# Altium project CorgiSDR.PrjPcb
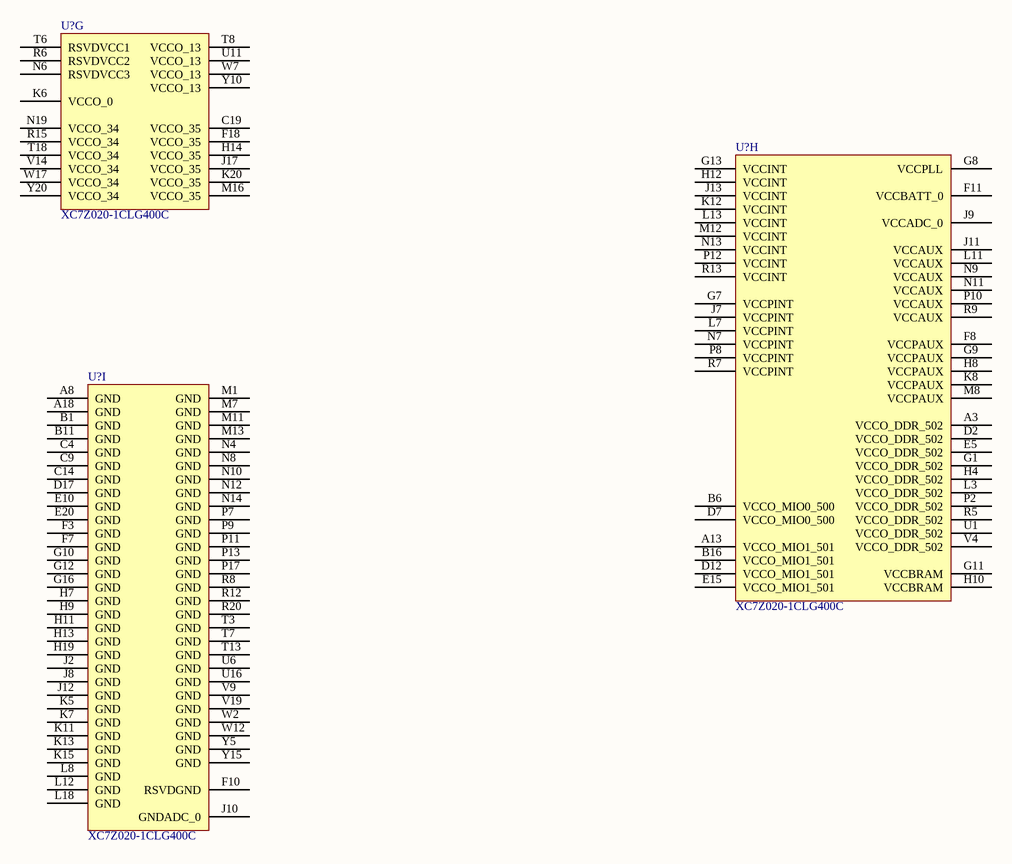
[diagram p0: FPGA Power.SchDoc]
8 sheets, 80 parts. Net scope: global (net labels, ports and power ports of the same name join across sheets).
Board file: CorgiSDR.PcbDoc
Sheets:
  FPGA Power.SchDoc
  DDR3 Memory Module One.SchDoc
  DDR3 Memory Module Two.SchDoc
  Memory Controller.SchDoc
  DDR3L Bypassing.SchDoc
  AD9361 RF Frontend.SchDoc
  AD9361 Baseband and Control.SchDoc
  AD9361 Power.SchDoc

## Sheet FPGA Power.SchDoc
size A4

### Parts
(Parts that share a designator on the sheet are numbered #1, #2 ... from top to bottom, then left to right.)
U?#1  XC7Z020-1CLG400C  [CLG400]  (part G of 9)
U?#2  XC7Z020-1CLG400C  [CLG400]  (part H of 9)
U?#3  XC7Z020-1CLG400C  [CLG400]  (part I of 9)

### Nets

Not connected (* = marked no-connect by the designer): U?#1 C19(VCCO_35) F18(VCCO_35) H14(VCCO_35) J17(VCCO_35) K6(VCCO_0) K20(VCCO_35) M16(VCCO_35) N6(RSVDVCC3) N19(VCCO_34) R6(RSVDVCC2) R15(VCCO_34) T6(RSVDVCC1) T8(VCCO_13) T18(VCCO_34) U11(VCCO_13) V14(VCCO_34) W7(VCCO_13) W17(VCCO_34) Y10(VCCO_13) Y20(VCCO_34); U?#2 A3(VCCO_DDR_502) A13(VCCO_MIO1_501) B6(VCCO_MIO0_500) B16(VCCO_MIO1_501) D2(VCCO_DDR_502) D7(VCCO_MIO0_500) D12(VCCO_MIO1_501) E5(VCCO_DDR_502) E15(VCCO_MIO1_501) F8(VCCPAUX) F11(VCCBATT_0) G1(VCCO_DDR_502) G7(VCCPINT) G8(VCCPLL) G9(VCCPAUX) G11(VCCBRAM) G13(VCCINT) H4(VCCO_DDR_502) H8(VCCPAUX) H10(VCCBRAM) H12(VCCINT) J7(VCCPINT) J9(VCCADC_0) J11(VCCAUX) J13(VCCINT) K8(VCCPAUX) K12(VCCINT) L3(VCCO_DDR_502) L7(VCCPINT) L11(VCCAUX) L13(VCCINT) M8(VCCPAUX) M12(VCCINT) N7(VCCPINT) N9(VCCAUX) N11(VCCAUX) N13(VCCINT) P2(VCCO_DDR_502) P8(VCCPINT) P10(VCCAUX) P12(VCCINT) R5(VCCO_DDR_502) R7(VCCPINT) R9(VCCAUX) R13(VCCINT) U1(VCCO_DDR_502) V4(VCCO_DDR_502); U?#3 A8(GND) A18(GND) B1(GND) B11(GND) C4(GND) C9(GND) C14(GND) D17(GND) E10(GND) E20(GND) F3(GND) F7(GND) F10(RSVDGND) G10(GND) G12(GND) G16(GND) H7(GND) H9(GND) H11(GND) H13(GND) H19(GND) J2(GND) J8(GND) J10(GNDADC_0) J12(GND) K5(GND) K7(GND) K11(GND) K13(GND) K15(GND) L8(GND) L12(GND) L18(GND) M1(GND) M7(GND) M11(GND) M13(GND) N4(GND) N8(GND) N10(GND) N12(GND) N14(GND) P7(GND) P9(GND) P11(GND) P13(GND) P17(GND) R8(GND) R12(GND) R20(GND) T3(GND) T7(GND) T13(GND) U6(GND) U16(GND) V9(GND) V19(GND) W2(GND) W12(GND) Y5(GND) Y15(GND)

### Notes on the sheet
- Title
- Size:
- Date:
- A3
- Drawn by:
- Time:
- Revision:
- Sheet
- of
- File:

### Library data of the parts
U?#1-U?#3 = CMP-0363-00002-3: SoC - 667 MHz Zynq™-7000 AP SoC, 130 PS I/O, 125 FPGA I/O, 400-Ball BGA, Speed Grade 1, Commercial Grade, Pb-Free; Flip Flops: 106400; Speed Grade: -1; LUTs: 53200; Extensible Block RAM (# 36Kb Blocks): 560 KB (140); PackageVersion: Rev 1.1, 09/2012; ComponentLink1Description: Datasheet; ComponentLink2Description: Package Specification; ComponentLink6Description: PCB and Layout Guide; PackageDescription: Wire-Bond Chip-Scale BGA, Body 17 x 17 mm, 0.8 mm Pitch; RoHS: Pb-Free; DatasheetVersion: v1.2; Mounting Technology: Surface Mount; ComponentLink5Description: Packaging and Pinout; ComponentLink5URL: http://www.xilinx.com/support/documentation/user_guides/ug865-Zynq-7000-Pkg-Pinout.pdf; ComponentLink6URL: http://www.xilinx.com/support/documentation/user_guides/ug483_7Series_PCB.pdf; Generic Part Number: XC7Z020; ComponentLink3Description: DC and AC Switching Characteristics; ComponentLink2URL: http://www.xilinx.com/support/documentation/user_guides/ug865-Zynq-7000-Pkg-Pinout.pdf; ComponentLink4Description: Package File; ComponentLink1URL: http://www.xilinx.com/support/documentation/data_sheets/ds190-Zynq-7000-Overview.pdf; PackageReference: CLG400; ComponentLink3URL: http://www.xilinx.com/support/documentation/data_sheets/ds187-XC7Z010-XC7Z020-Data-Sheet.pdf; PartNumber: XC7Z020-1CLG400C; ComponentLink4URL: http://www.xilinx.com/support/packagefiles/z7packages/xc7z020clg400pkg.txt; Code_JEDEC: MO-275-MMAA-1

## Sheet DDR3 Memory Module One.SchDoc: DDR3L Module (1/2)
size A4; DrawnBy: Chris Segiet; Revision: v1.0.0
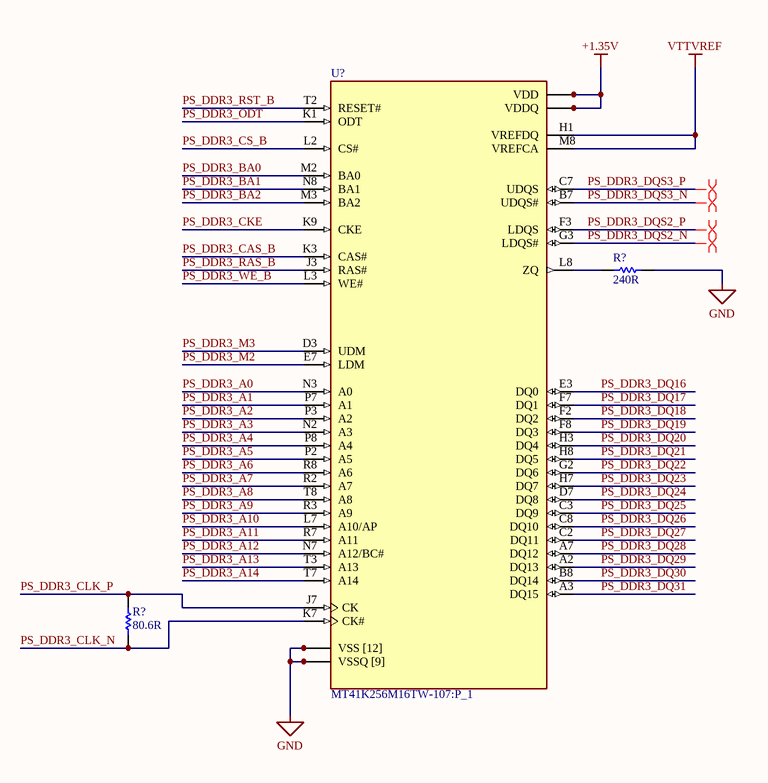
[diagram p1: DDR3 Memory Module One.SchDoc]

### Parts
(Parts that share a designator on the sheet are numbered #1, #2 ... from top to bottom, then left to right.)
R?#1  240R  [RESC1005X40X25NL05T05]
R?#2  80.6R  [RESC1005X40X25NL05T05]
U?#4  MT41K256M16TW-107:P_1  [BGA96C80P9X16_1400X800X120]

### Nets
+1.35V: R?#1.2 U?#4.A1(VDDQ) U?#4.A8(VDDQ) U?#4.A9(VSS_[12]) U?#4.B1(VSSQ) U?#4.B2(VDD) U?#4.B3(VSS) U?#4.B9(VSSQ) U?#4.C1(VDDQ) U?#4.C9(VDDQ) U?#4.D1(VSSQ) U?#4.D2(VDDQ) U?#4.D8(VSSQ) U?#4.D9(VDD) U?#4.E1(VSS) U?#4.E2(VSSQ) U?#4.E8(VSSQ) U?#4.E9(VDDQ) U?#4.F1(VDDQ) U?#4.F9(VSSQ) U?#4.G1(VSSQ) U?#4.G7(VDD) U?#4.G8(VSS) U?#4.G9(VSSQ_[9]) U?#4.H2(VDDQ) U?#4.H9(VDDQ) U?#4.J2(VSS) U?#4.J8(VSS) U?#4.K2(VDD) U?#4.K8(VDD) U?#4.M1(VSS) U?#4.M9(VSS) U?#4.N1(VDD) U?#4.N9(VDD) U?#4.P1(VSS) U?#4.P9(VSS) U?#4.R1(VDD) U?#4.R9(VDD) U?#4.T1(VSS) U?#4.T9(VSS)  [also labelled GND]
VTTVREF: U?#4.H1(VREFDQ) U?#4.M8(VREFCA)  [project net PS_DDR_VREF0]
PS_DDR3_A0: U?#4.N3(A0)
PS_DDR3_A1: U?#4.P7(A1)
PS_DDR3_A2: U?#4.P3(A2)
PS_DDR3_A3: U?#4.N2(A3)
PS_DDR3_A4: U?#4.P8(A4)
PS_DDR3_A5: U?#4.P2(A5)
PS_DDR3_A6: U?#4.R8(A6)
PS_DDR3_A7: U?#4.R2(A7)
PS_DDR3_A8: U?#4.T8(A8)
PS_DDR3_A9: U?#4.R3(A9)
PS_DDR3_A10: U?#4.L7(A10/AP)
PS_DDR3_A11: U?#4.R7(A11)
PS_DDR3_A12: U?#4.N7(A12/BC#)
PS_DDR3_A13: U?#4.T3(A13)
PS_DDR3_A14: U?#4.T7(A14)
PS_DDR3_BA0: U?#4.M2(BA0)
PS_DDR3_BA1: U?#4.N8(BA1)
PS_DDR3_BA2: U?#4.M3(BA2)
PS_DDR3_CAS_B: U?#4.K3(CAS#)
PS_DDR3_CKE: U?#4.K9(CKE)
PS_DDR3_CLK_N: R?#2.2 U?#4.K7(CK#)
PS_DDR3_CLK_P: R?#2.1 U?#4.J7(CK)
PS_DDR3_CS_B: U?#4.L2(CS#)
PS_DDR3_DQ16: U?#4.E3(DQ0)
PS_DDR3_DQ17: U?#4.F7(DQ1)
PS_DDR3_DQ18: U?#4.F2(DQ2)
PS_DDR3_DQ19: U?#4.F8(DQ3)
PS_DDR3_DQ20: U?#4.H3(DQ4)
PS_DDR3_DQ21: U?#4.H8(DQ5)
PS_DDR3_DQ22: U?#4.G2(DQ6)
PS_DDR3_DQ23: U?#4.H7(DQ7)
PS_DDR3_DQ24: U?#4.D7(DQ8)
PS_DDR3_DQ25: U?#4.C3(DQ9)
PS_DDR3_DQ26: U?#4.C8(DQ10)
PS_DDR3_DQ27: U?#4.C2(DQ11)
PS_DDR3_DQ28: U?#4.A7(DQ12)
PS_DDR3_DQ29: U?#4.A2(DQ13)
PS_DDR3_DQ30: U?#4.B8(DQ14)
PS_DDR3_DQ31: U?#4.A3(DQ15)
PS_DDR3_DQS2_N: U?#4.G3(LDQS#)
PS_DDR3_DQS2_P: U?#4.F3(LDQS)
PS_DDR3_DQS3_N: U?#4.B7(UDQS#)
PS_DDR3_DQS3_P: U?#4.C7(UDQS)
PS_DDR3_M2: U?#4.E7(LDM)
PS_DDR3_M3: U?#4.D3(UDM)
PS_DDR3_ODT: U?#4.K1(ODT)
PS_DDR3_RAS_B: U?#4.J3(RAS#)
PS_DDR3_RST_B: U?#4.T2(RESET#)
PS_DDR3_WE_B: U?#4.L3(WE#)
NetR?#1_1: R?#1.1 U?#4.L8(ZQ)

### Layout directives
differential pair: PS_DDR3_DQS2_N, PS_DDR3_DQS2_P, PS_DDR3_DQS3_N, PS_DDR3_DQS3_P

### Notes on the sheet
- Title
- Size:
- Date:
- A3
- Drawn by:
- Time:
- Revision:
- Sheet
- of
- File:

### Library data of the parts
R?#1 = CMP-2002-00493-3: Resistor - 240 Ohm, +/- 5%, 100 mW, 0402; PartNumber: ERJ-2GEJ241x; Manufacturer: Basic Passives; Resistance: 240 Ohm; Voltage Rating: 50 V; Case\/Package: 0402; Power Rating: 100 mW; PackageReference: 0402; ComponentLink1URL: http://www.panasonic.com/; ComponentLink2Description: Datasheet; PackageDescription: 2-Pin Surface Mount Device, Body 1 x 0.5 mm; Tolerance: 5%; Radiation Hardening: No; Packaging: Tape and Reel; Case Code (Metric): 1005; Case Code (Imperial): 0402; Mount: Surface Mount; REACH SVHC: Yes; Length: 1 mm; Mounting Technology: Surface Mount; Max Operating Temperature: 155 degC; Height: 0.35 mm; Width: 0.5 mm; Package Quantity: 10000; RoHSCompliant: true; DatasheetVersion: 03/2015; Pins: 2; ComponentLink1Description: Manufacturer URL; Min Operating Temperature: -55 degC; ComponentLink2URL: http://industrial.panasonic.com/cdbs/www-data/pdf/RDA0000/AOA0000C84.pdf
R?#2 = CMP-2002-01076-1: Resistor - 80.6R 1% 0.1W 0402; Manufacturer: Panasonic; Part Number: ERJ-2RKF80R6X; Resistance: 80.6; Category: Resistor; Tolerance: 1%; Power Rating: 0.1W; Case Code (Imperial): 0402
U?#4 = MT41K256M16TW-107:P_1: Memory - DDR3L Memory IC 4Gb (256M x 16) Parallel 933MHz 20ns 96-FBGA (8x14); MF: {'manufacturer': u'Micron Technology Inc.'}; Price: None; Value: *; Package: None; Availability: Unavailable; MP: MT41K256M16TW-107:P; Category: Memory

## Sheet DDR3 Memory Module Two.SchDoc: DDR3L Module (2/2)
size A4; DrawnBy: Chris Segiet; Revision: v1.0.0
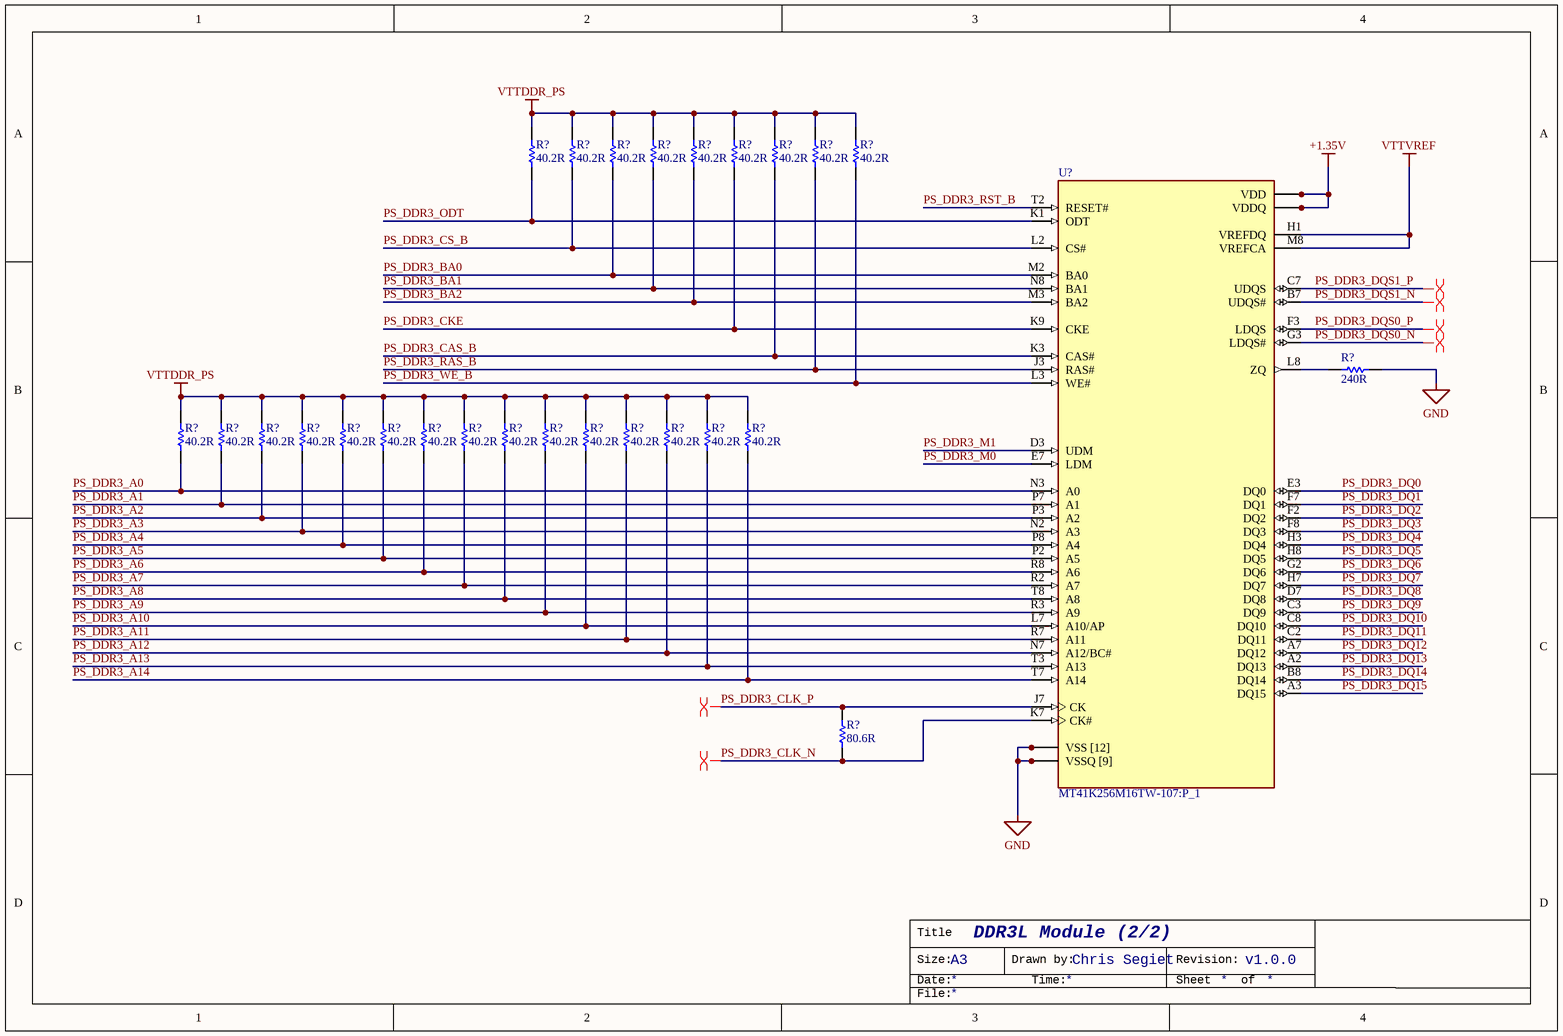
[diagram p2: DDR3 Memory Module Two.SchDoc]

### Parts
(Parts that share a designator on the sheet are numbered #1, #2 ... from top to bottom, then left to right.)
R?#3  40.2R  [FP-CRCW0603-e3-IPC_B]
R?#4  40.2R  [FP-CRCW0603-e3-IPC_B]
R?#5  40.2R  [FP-CRCW0603-e3-IPC_B]
R?#6  40.2R  [FP-CRCW0603-e3-IPC_B]
R?#7  40.2R  [FP-CRCW0603-e3-IPC_B]
R?#8  40.2R  [FP-CRCW0603-e3-IPC_B]
R?#9  40.2R  [FP-CRCW0603-e3-IPC_B]
R?#10  40.2R  [FP-CRCW0603-e3-IPC_B]
R?#11  40.2R  [FP-CRCW0603-e3-IPC_B]
R?#12  240R  [RESC1005X40X25NL05T05]
R?#13  40.2R  [FP-CRCW0603-e3-IPC_B]
R?#14  40.2R  [FP-CRCW0603-e3-IPC_B]
R?#15  40.2R  [FP-CRCW0603-e3-IPC_B]
R?#16  40.2R  [FP-CRCW0603-e3-IPC_B]
R?#17  40.2R  [FP-CRCW0603-e3-IPC_B]
R?#18  40.2R  [FP-CRCW0603-e3-IPC_B]
R?#19  40.2R  [FP-CRCW0603-e3-IPC_B]
R?#20  40.2R  [FP-CRCW0603-e3-IPC_B]
R?#21  40.2R  [FP-CRCW0603-e3-IPC_B]
R?#22  40.2R  [FP-CRCW0603-e3-IPC_B]
R?#23  40.2R  [FP-CRCW0603-e3-IPC_B]
R?#24  40.2R  [FP-CRCW0603-e3-IPC_B]
R?#25  40.2R  [FP-CRCW0603-e3-IPC_B]
R?#26  40.2R  [FP-CRCW0603-e3-IPC_B]
R?#27  40.2R  [FP-CRCW0603-e3-IPC_B]
R?#28  80.6R  [RESC1005X40X25NL05T05]
U?#5  MT41K256M16TW-107:P_1  [BGA96C80P9X16_1400X800X120]

### Nets
+1.35V: R?#12.2 U?#5.A1(VDDQ) U?#5.A8(VDDQ) U?#5.A9(VSS_[12]) U?#5.B1(VSSQ) U?#5.B2(VDD) U?#5.B3(VSS) U?#5.B9(VSSQ) U?#5.C1(VDDQ) U?#5.C9(VDDQ) U?#5.D1(VSSQ) U?#5.D2(VDDQ) U?#5.D8(VSSQ) U?#5.D9(VDD) U?#5.E1(VSS) U?#5.E2(VSSQ) U?#5.E8(VSSQ) U?#5.E9(VDDQ) U?#5.F1(VDDQ) U?#5.F9(VSSQ) U?#5.G1(VSSQ) U?#5.G7(VDD) U?#5.G8(VSS) U?#5.G9(VSSQ_[9]) U?#5.H2(VDDQ) U?#5.H9(VDDQ) U?#5.J2(VSS) U?#5.J8(VSS) U?#5.K2(VDD) U?#5.K8(VDD) U?#5.M1(VSS) U?#5.M9(VSS) U?#5.N1(VDD) U?#5.N9(VDD) U?#5.P1(VSS) U?#5.P9(VSS) U?#5.R1(VDD) U?#5.R9(VDD) U?#5.T1(VSS) U?#5.T9(VSS)  [also labelled GND]
VTTDDR_PS: R?#3.2 R?#4.2 R?#5.2 R?#6.2 R?#7.2 R?#8.2 R?#9.2 R?#10.2 R?#11.2 R?#13.2 R?#14.2 R?#15.2 R?#16.2 R?#17.2 R?#18.2 R?#19.2 R?#20.2 R?#21.2 R?#22.2 R?#23.2 R?#24.2 R?#25.2 R?#26.2 R?#27.2
VTTVREF: U?#5.H1(VREFDQ) U?#5.M8(VREFCA)  [project net PS_DDR_VREF0]
PS_DDR3_A0: R?#13.1 U?#5.N3(A0)
PS_DDR3_A1: R?#14.1 U?#5.P7(A1)
PS_DDR3_A2: R?#15.1 U?#5.P3(A2)
PS_DDR3_A3: R?#16.1 U?#5.N2(A3)
PS_DDR3_A4: R?#17.1 U?#5.P8(A4)
PS_DDR3_A5: R?#18.1 U?#5.P2(A5)
PS_DDR3_A6: R?#19.1 U?#5.R8(A6)
PS_DDR3_A7: R?#20.1 U?#5.R2(A7)
PS_DDR3_A8: R?#21.1 U?#5.T8(A8)
PS_DDR3_A9: R?#22.1 U?#5.R3(A9)
PS_DDR3_A10: R?#23.1 U?#5.L7(A10/AP)
PS_DDR3_A11: R?#24.1 U?#5.R7(A11)
PS_DDR3_A12: R?#25.1 U?#5.N7(A12/BC#)
PS_DDR3_A13: R?#26.1 U?#5.T3(A13)
PS_DDR3_A14: R?#27.1 U?#5.T7(A14)
PS_DDR3_BA0: R?#5.1 U?#5.M2(BA0)
PS_DDR3_BA1: R?#6.1 U?#5.N8(BA1)
PS_DDR3_BA2: R?#7.1 U?#5.M3(BA2)
PS_DDR3_CAS_B: R?#9.1 U?#5.K3(CAS#)
PS_DDR3_CKE: R?#8.1 U?#5.K9(CKE)
PS_DDR3_CLK_N: R?#28.1 U?#5.K7(CK#)
PS_DDR3_CLK_P: R?#28.2 U?#5.J7(CK)
PS_DDR3_CS_B: R?#4.1 U?#5.L2(CS#)
PS_DDR3_DQ0: U?#5.E3(DQ0)
PS_DDR3_DQ1: U?#5.F7(DQ1)
PS_DDR3_DQ2: U?#5.F2(DQ2)
PS_DDR3_DQ3: U?#5.F8(DQ3)
PS_DDR3_DQ4: U?#5.H3(DQ4)
PS_DDR3_DQ5: U?#5.H8(DQ5)
PS_DDR3_DQ6: U?#5.G2(DQ6)
PS_DDR3_DQ7: U?#5.H7(DQ7)
PS_DDR3_DQ8: U?#5.D7(DQ8)
PS_DDR3_DQ9: U?#5.C3(DQ9)
PS_DDR3_DQ10: U?#5.C8(DQ10)
PS_DDR3_DQ11: U?#5.C2(DQ11)
PS_DDR3_DQ12: U?#5.A7(DQ12)
PS_DDR3_DQ13: U?#5.A2(DQ13)
PS_DDR3_DQ14: U?#5.B8(DQ14)
PS_DDR3_DQ15: U?#5.A3(DQ15)
PS_DDR3_DQS0_N: U?#5.G3(LDQS#)
PS_DDR3_DQS0_P: U?#5.F3(LDQS)
PS_DDR3_DQS1_N: U?#5.B7(UDQS#)
PS_DDR3_DQS1_P: U?#5.C7(UDQS)
PS_DDR3_M0: U?#5.E7(LDM)
PS_DDR3_M1: U?#5.D3(UDM)
PS_DDR3_ODT: R?#3.1 U?#5.K1(ODT)
PS_DDR3_RAS_B: R?#10.1 U?#5.J3(RAS#)
PS_DDR3_RST_B: U?#5.T2(RESET#)
PS_DDR3_WE_B: R?#11.1 U?#5.L3(WE#)
NetR?#12_1: R?#12.1 U?#5.L8(ZQ)

### Layout directives
differential pair: PS_DDR3_CLK_N, PS_DDR3_CLK_P, PS_DDR3_DQS0_N, PS_DDR3_DQS0_P, PS_DDR3_DQS1_N, PS_DDR3_DQS1_P

### Notes on the sheet
- Title
- Size:
- Date:
- A3
- Drawn by:
- Time:
- Revision:
- Sheet
- of
- File:

### Library data of the parts
R?#3-R?#11 R?#13-R?#27 = CMP-1012-00352-3: Resistor - 40.2Ω, 1%, 0.1W, 100ppm/°C, 0603; Max Power Dissipation: 100mW; Voltage Rating (DC): 75V; Packaging: Tape and Reel; Mount: Surface Mount; Composition: Thick Film; Case Code (Metric): 1608; Case/Package: 0603; Radiation Hardening: No; Min Operating Temperature: -55°C; Resistance: 40.2R; Power Rating: 100mW; Width: 0.033inch; Temperature Coefficient: 100ppm/°C; Tolerance: 1%; Termination: SMD/SMT; Case Code (Imperial): 0603; Features: Automotive AEC-Q200; Lead Free: Lead Free; Number of Terminations: 2; Max Operating Temperature: 155°C; Height: 0.45mm; Depth: 0.85mm; Military Standard: Not; Number of Pins: 2; Package Quantity: 10; Contact Plating: Tin; Weight: 7.1E-05oz; Voltage Rating: 75V; Length: 1.55mm
R?#12 = CMP-2002-00493-3: as R?#1 on sheet DDR3 Memory Module One; PackageReference: 0402; ComponentLink1URL: http://www.panasonic.com/; ComponentLink2Description: Datasheet; PackageDescription: 2-Pin Surface Mount Device, Body 1 x 0.5 mm; Tolerance: 5%; Radiation Hardening: No; Packaging: Tape and Reel; Case Code (Metric): 1005; Case Code (Imperial): 0402; Mount: Surface Mount; REACH SVHC: Yes; Length: 1 mm; Mounting Technology: Surface Mount; Max Operating Temperature: 155 degC; Height: 0.35 mm; Width: 0.5 mm; Package Quantity: 10000; RoHSCompliant: true; DatasheetVersion: 03/2015; Pins: 2; ComponentLink1Description: Manufacturer URL; Min Operating Temperature: -55 degC; ComponentLink2URL: http://industrial.panasonic.com/cdbs/www-data/pdf/RDA0000/AOA0000C84.pdf
R?#28 = CMP-2002-01076-1: as R?#2 on sheet DDR3 Memory Module One; Category: Resistor; Tolerance: 1%; Power Rating: 0.1W; Case Code (Imperial): 0402
U?#5 = MT41K256M16TW-107:P_1: as U?#4 on sheet DDR3 Memory Module One; Price: None; Value: *; Package: None; Availability: Unavailable; MP: MT41K256M16TW-107:P; Category: Memory

## Sheet Memory Controller.SchDoc: DDR3L Memory Controller (HPS)
size A4; DrawnBy: Chris Segiet; Revision: v1.0.0
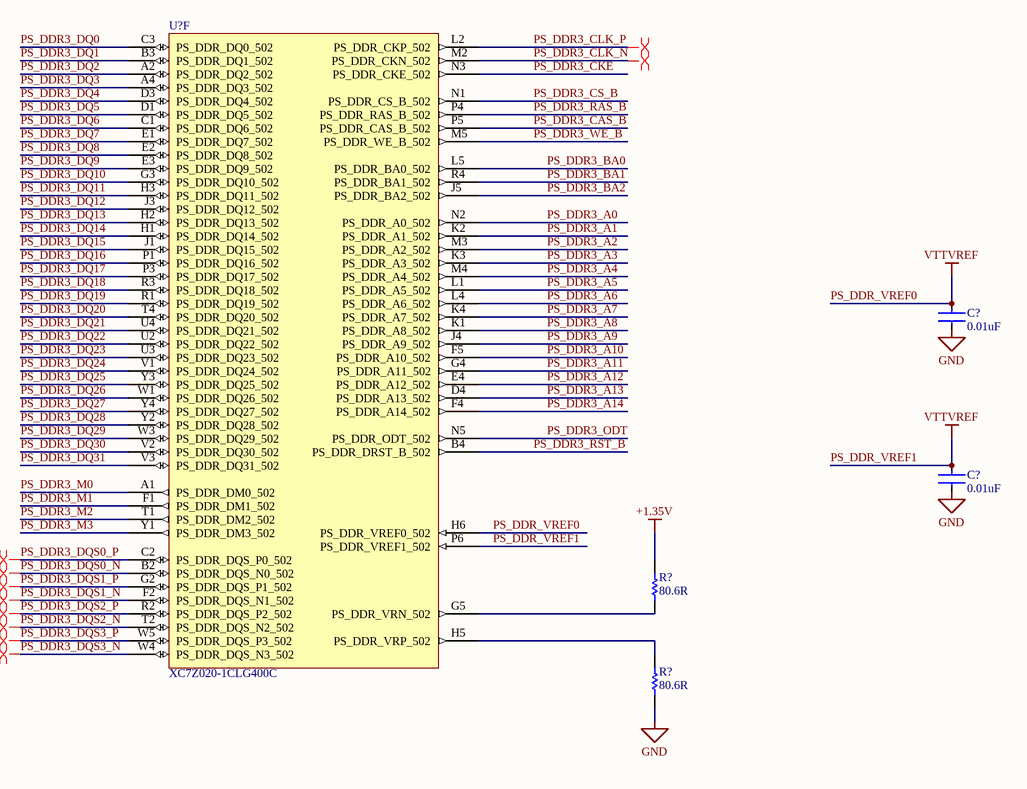
[diagram p3: Memory Controller.SchDoc]

### Parts
(Parts that share a designator on the sheet are numbered #1, #2 ... from top to bottom, then left to right.)
C?#1  0.01uF  [FP-C1005-050-0_05-IPC_B]
C?#2  0.01uF  [FP-C1005-050-0_05-IPC_B]
R?#29  80.6R  [RESC1005X40X25NL05T05]
R?#30  80.6R  [RESC1005X40X25NL05T05]
U?#6  XC7Z020-1CLG400C  [CLG400]  (part F of 9)

### Nets
+1.35V: C?#1.2 C?#2.2 R?#29.2 R?#30.1  [also labelled GND]
PS_DDR_VREF0: C?#1.1 C?#2.1 U?#6.H6(PS_DDR_VREF0_502) U?#6.P6(PS_DDR_VREF1_502)  [also labelled PS_DDR_VREF1, VTTVREF]
PS_DDR3_A0: U?#6.N2(PS_DDR_A0_502)
PS_DDR3_A1: U?#6.K2(PS_DDR_A1_502)
PS_DDR3_A2: U?#6.M3(PS_DDR_A2_502)
PS_DDR3_A3: U?#6.K3(PS_DDR_A3_502)
PS_DDR3_A4: U?#6.M4(PS_DDR_A4_502)
PS_DDR3_A5: U?#6.L1(PS_DDR_A5_502)
PS_DDR3_A6: U?#6.L4(PS_DDR_A6_502)
PS_DDR3_A7: U?#6.K4(PS_DDR_A7_502)
PS_DDR3_A8: U?#6.K1(PS_DDR_A8_502)
PS_DDR3_A9: U?#6.J4(PS_DDR_A9_502)
PS_DDR3_A10: U?#6.F5(PS_DDR_A10_502)
PS_DDR3_A11: U?#6.G4(PS_DDR_A11_502)
PS_DDR3_A12: U?#6.E4(PS_DDR_A12_502)
PS_DDR3_A13: U?#6.D4(PS_DDR_A13_502)
PS_DDR3_A14: U?#6.F4(PS_DDR_A14_502)
PS_DDR3_BA0: U?#6.L5(PS_DDR_BA0_502)
PS_DDR3_BA1: U?#6.R4(PS_DDR_BA1_502)
PS_DDR3_BA2: U?#6.J5(PS_DDR_BA2_502)
PS_DDR3_CAS_B: U?#6.P5(PS_DDR_CAS_B_502)
PS_DDR3_CKE: U?#6.N3(PS_DDR_CKE_502)
PS_DDR3_CLK_N: U?#6.M2(PS_DDR_CKN_502)
PS_DDR3_CLK_P: U?#6.L2(PS_DDR_CKP_502)
PS_DDR3_CS_B: U?#6.N1(PS_DDR_CS_B_502)
PS_DDR3_DQ0: U?#6.C3(PS_DDR_DQ0_502)
PS_DDR3_DQ1: U?#6.B3(PS_DDR_DQ1_502)
PS_DDR3_DQ2: U?#6.A2(PS_DDR_DQ2_502)
PS_DDR3_DQ3: U?#6.A4(PS_DDR_DQ3_502)
PS_DDR3_DQ4: U?#6.D3(PS_DDR_DQ4_502)
PS_DDR3_DQ5: U?#6.D1(PS_DDR_DQ5_502)
PS_DDR3_DQ6: U?#6.C1(PS_DDR_DQ6_502)
PS_DDR3_DQ7: U?#6.E1(PS_DDR_DQ7_502)
PS_DDR3_DQ8: U?#6.E2(PS_DDR_DQ8_502)
PS_DDR3_DQ9: U?#6.E3(PS_DDR_DQ9_502)
PS_DDR3_DQ10: U?#6.G3(PS_DDR_DQ10_502)
PS_DDR3_DQ11: U?#6.H3(PS_DDR_DQ11_502)
PS_DDR3_DQ12: U?#6.J3(PS_DDR_DQ12_502)
PS_DDR3_DQ13: U?#6.H2(PS_DDR_DQ13_502)
PS_DDR3_DQ14: U?#6.H1(PS_DDR_DQ14_502)
PS_DDR3_DQ15: U?#6.J1(PS_DDR_DQ15_502)
PS_DDR3_DQ16: U?#6.P1(PS_DDR_DQ16_502)
PS_DDR3_DQ17: U?#6.P3(PS_DDR_DQ17_502)
PS_DDR3_DQ18: U?#6.R3(PS_DDR_DQ18_502)
PS_DDR3_DQ19: U?#6.R1(PS_DDR_DQ19_502)
PS_DDR3_DQ20: U?#6.T4(PS_DDR_DQ20_502)
PS_DDR3_DQ21: U?#6.U4(PS_DDR_DQ21_502)
PS_DDR3_DQ22: U?#6.U2(PS_DDR_DQ22_502)
PS_DDR3_DQ23: U?#6.U3(PS_DDR_DQ23_502)
PS_DDR3_DQ24: U?#6.V1(PS_DDR_DQ24_502)
PS_DDR3_DQ25: U?#6.Y3(PS_DDR_DQ25_502)
PS_DDR3_DQ26: U?#6.W1(PS_DDR_DQ26_502)
PS_DDR3_DQ27: U?#6.Y4(PS_DDR_DQ27_502)
PS_DDR3_DQ28: U?#6.Y2(PS_DDR_DQ28_502)
PS_DDR3_DQ29: U?#6.W3(PS_DDR_DQ29_502)
PS_DDR3_DQ30: U?#6.V2(PS_DDR_DQ30_502)
PS_DDR3_DQ31: U?#6.V3(PS_DDR_DQ31_502)
PS_DDR3_DQS0_N: U?#6.B2(PS_DDR_DQS_N0_502)
PS_DDR3_DQS0_P: U?#6.C2(PS_DDR_DQS_P0_502)
PS_DDR3_DQS1_N: U?#6.F2(PS_DDR_DQS_N1_502)
PS_DDR3_DQS1_P: U?#6.G2(PS_DDR_DQS_P1_502)
PS_DDR3_DQS2_N: U?#6.T2(PS_DDR_DQS_N2_502)
PS_DDR3_DQS2_P: U?#6.R2(PS_DDR_DQS_P2_502)
PS_DDR3_DQS3_N: U?#6.W4(PS_DDR_DQS_N3_502)
PS_DDR3_DQS3_P: U?#6.W5(PS_DDR_DQS_P3_502)
PS_DDR3_M0: U?#6.A1(PS_DDR_DM0_502)
PS_DDR3_M1: U?#6.F1(PS_DDR_DM1_502)
PS_DDR3_M2: U?#6.T1(PS_DDR_DM2_502)
PS_DDR3_M3: U?#6.Y1(PS_DDR_DM3_502)
PS_DDR3_ODT: U?#6.N5(PS_DDR_ODT_502)
PS_DDR3_RAS_B: U?#6.P4(PS_DDR_RAS_B_502)
PS_DDR3_RST_B: U?#6.B4(PS_DDR_DRST_B_502)
PS_DDR3_WE_B: U?#6.M5(PS_DDR_WE_B_502)
NetR?#29_1: R?#29.1 U?#6.G5(PS_DDR_VRN_502)
NetR?#30_2: R?#30.2 U?#6.H5(PS_DDR_VRP_502)

### Layout directives
differential pair: PS_DDR3_CLK_N, PS_DDR3_CLK_P, PS_DDR3_DQS0_N, PS_DDR3_DQS0_P, PS_DDR3_DQS1_N, PS_DDR3_DQS1_P, PS_DDR3_DQS2_N, PS_DDR3_DQS2_P, PS_DDR3_DQS3_N, PS_DDR3_DQS3_P

### Notes on the sheet
- Title
- Size:
- Date:
- A3
- Drawn by:
- Time:
- Revision:
- Sheet
- of
- File:

### Library data of the parts
C?#1 C?#2 = CMP-08246-000726-2: Multilayer Ceramic Capacitors 10nF ±10% 25V X8R SMD 0402; Dissipation Factor: 3%; Length: 1mm; Capacitance: 10nF; Termination: SMD/SMT; Packaging: Tape and Reel; Weight: 2.3E-05oz; Resistor Type: Ceramic; Case/Package: 0402; Number of Pins: 2; Voltage Rating (DC): 25V; Voltage: 25V; Width: 0.02inch; Tolerance: 10%; Depth: 0.5mm; Case Code (Metric): 1005; Dielectric: X8R; RoHS Compliant: Yes; Max Operating Temperature: 150°C; Features: High Temperature; Voltage Rating: 25V; REACH SVHC: No SVHC; Series: C; Package Quantity: 10000; Mount: Surface Mount; Dielectric Material: Ceramic; Case Code (Imperial): 0402; Lead Free: Lead Free; Thickness: 0.022inch; Height: 0.5mm; Min Operating Temperature: -55°C
R?#29 R?#30 = CMP-2002-01076-1: 80.6 ohm 1% 0402; Manufacturer: Panasonic; Part Number: ERJ-2RKF80R6X
U?#6 = CMP-0363-00002-3: 667 MHz Zynq™-7000 AP SoC, 130 PS I/O, 125 FPGA I/O, 400-Ball BGA, Speed Grade 1, Commercial Grade, Pb-Free; Flip Flops: 106400; Speed Grade: -1; LUTs: 53200; Extensible Block RAM (# 36Kb Blocks): 560 KB (140); PackageVersion: Rev 1.1, 09/2012; ComponentLink1Description: Datasheet; ComponentLink2Description: Package Specification; ComponentLink6Description: PCB and Layout Guide; PackageDescription: Wire-Bond Chip-Scale BGA, Body 17 x 17 mm, 0.8 mm Pitch; RoHS: Pb-Free; DatasheetVersion: v1.2; Mounting Technology: Surface Mount; ComponentLink5Description: Packaging and Pinout; ComponentLink5URL: http://www.xilinx.com/support/documentation/user_guides/ug865-Zynq-7000-Pkg-Pinout.pdf; ComponentLink6URL: http://www.xilinx.com/support/documentation/user_guides/ug483_7Series_PCB.pdf; Generic Part Number: XC7Z020; ComponentLink3Description: DC and AC Switching Characteristics; ComponentLink2URL: http://www.xilinx.com/support/documentation/user_guides/ug865-Zynq-7000-Pkg-Pinout.pdf; ComponentLink4Description: Package File; ComponentLink1URL: http://www.xilinx.com/support/documentation/data_sheets/ds190-Zynq-7000-Overview.pdf; PackageReference: CLG400; ComponentLink3URL: http://www.xilinx.com/support/documentation/data_sheets/ds187-XC7Z010-XC7Z020-Data-Sheet.pdf; PartNumber: XC7Z020-1CLG400C; ComponentLink4URL: http://www.xilinx.com/support/packagefiles/z7packages/xc7z020clg400pkg.txt; Code_JEDEC: MO-275-MMAA-1

## Sheet DDR3L Bypassing.SchDoc: DDR3L Bypassing
size A4; DrawnBy: Chris Segiet; Revision: v1.0.0
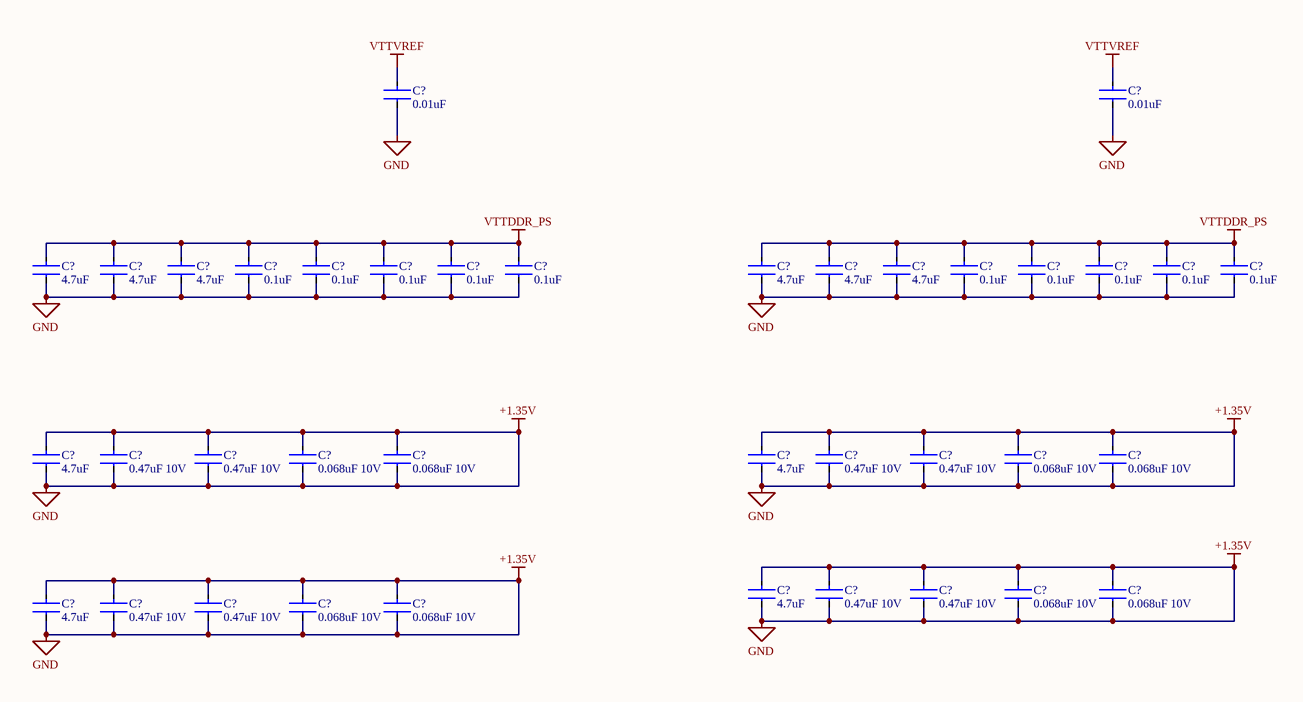
[diagram p4: DDR3L Bypassing.SchDoc]

### Parts
(Parts that share a designator on the sheet are numbered #1, #2 ... from top to bottom, then left to right.)
C?#3  0.01uF  [FP-C1005-050-0_05-IPC_B]
C?#4  0.01uF  [FP-C1005-050-0_05-IPC_B]
C?#5  4.7uF  [FP-C2012-125-0_2-IPC_B]
C?#6  4.7uF  [FP-C2012-125-0_2-IPC_B]
C?#7  4.7uF  [FP-C2012-125-0_2-IPC_B]
C?#8  0.1uF  [FP-CGA3E-0_3-0_1-IPC_B]
C?#9  0.1uF  [FP-CGA3E-0_3-0_1-IPC_B]
C?#10  0.1uF  [FP-CGA3E-0_3-0_1-IPC_B]
C?#11  0.1uF  [FP-CGA3E-0_3-0_1-IPC_B]
C?#12  0.1uF  [FP-CGA3E-0_3-0_1-IPC_B]
C?#13  4.7uF  [FP-C2012-125-0_2-IPC_B]
C?#14  4.7uF  [FP-C2012-125-0_2-IPC_B]
C?#15  4.7uF  [FP-C2012-125-0_2-IPC_B]
C?#16  0.1uF  [FP-CGA3E-0_3-0_1-IPC_B]
C?#17  0.1uF  [FP-CGA3E-0_3-0_1-IPC_B]
C?#18  0.1uF  [FP-CGA3E-0_3-0_1-IPC_B]
C?#19  0.1uF  [FP-CGA3E-0_3-0_1-IPC_B]
C?#20  0.1uF  [FP-CGA3E-0_3-0_1-IPC_B]
C?#21  4.7uF  [FP-C2012-125-0_2-IPC_B]
C?#22  0.47uF 10V  [FP-GRM15-0_1-IPC_B]
C?#23  0.47uF 10V  [FP-GRM15-0_1-IPC_B]
C?#24  0.068uF 10V  [FP-C1005-050-0_05-IPC_B]
C?#25  0.068uF 10V  [FP-C1005-050-0_05-IPC_B]
C?#26  4.7uF  [FP-C2012-125-0_2-IPC_B]
C?#27  0.47uF 10V  [FP-GRM15-0_1-IPC_B]
C?#28  0.47uF 10V  [FP-GRM15-0_1-IPC_B]
C?#29  0.068uF 10V  [FP-C1005-050-0_05-IPC_B]
C?#30  0.068uF 10V  [FP-C1005-050-0_05-IPC_B]
C?#31  4.7uF  [FP-C2012-125-0_2-IPC_B]
C?#32  0.47uF 10V  [FP-GRM15-0_1-IPC_B]
C?#33  0.47uF 10V  [FP-GRM15-0_1-IPC_B]
C?#34  0.068uF 10V  [FP-C1005-050-0_05-IPC_B]
C?#35  0.068uF 10V  [FP-C1005-050-0_05-IPC_B]
C?#36  4.7uF  [FP-C2012-125-0_2-IPC_B]
C?#37  0.47uF 10V  [FP-GRM15-0_1-IPC_B]
C?#38  0.47uF 10V  [FP-GRM15-0_1-IPC_B]
C?#39  0.068uF 10V  [FP-C1005-050-0_05-IPC_B]
C?#40  0.068uF 10V  [FP-C1005-050-0_05-IPC_B]

### Nets
+1.35V: C?#3.2 C?#4.2 C?#5.2 C?#6.2 C?#7.2 C?#8.2 C?#9.2 C?#10.2 C?#11.2 C?#12.2 C?#13.2 C?#14.2 C?#15.2 C?#16.2 C?#17.2 C?#18.2 C?#19.2 C?#20.2 C?#21.1 C?#21.2 C?#22.1 C?#22.2 C?#23.1 C?#23.2 C?#24.1 C?#24.2 C?#25.1 C?#25.2 C?#26.1 C?#26.2 C?#27.1 C?#27.2 C?#28.1 C?#28.2 C?#29.1 C?#29.2 C?#30.1 C?#30.2 C?#31.1 C?#31.2 C?#32.1 C?#32.2 C?#33.1 C?#33.2 C?#34.1 C?#34.2 C?#35.1 C?#35.2 C?#36.1 C?#36.2 C?#37.1 C?#37.2 C?#38.1 C?#38.2 C?#39.1 C?#39.2 C?#40.1 C?#40.2  [also labelled GND]
VTTDDR_PS: C?#5.1 C?#6.1 C?#7.1 C?#8.1 C?#9.1 C?#10.1 C?#11.1 C?#12.1 C?#13.1 C?#14.1 C?#15.1 C?#16.1 C?#17.1 C?#18.1 C?#19.1 C?#20.1
VTTVREF: C?#3.1 C?#4.1  [project net PS_DDR_VREF0]

### Notes on the sheet
- Title
- Size:
- Date:
- A3
- Drawn by:
- Time:
- Revision:
- Sheet
- of
- File:

### Library data of the parts
C?#3 C?#4 = CMP-08246-000726-2: Ceramic Capacitor - 10nF ±10% 25V X8R SMD 0402; Dissipation Factor: 3%; Length: 1mm; Capacitance: 10nF; Termination: SMD/SMT; Packaging: Tape and Reel; Weight: 2.3E-05oz; Resistor Type: Ceramic; Case/Package: 0402; Number of Pins: 2; Voltage Rating (DC): 25V; Voltage: 25V; Width: 0.02inch; Tolerance: 10%; Depth: 0.5mm; Case Code (Metric): 1005; Dielectric: X8R; RoHS Compliant: Yes; Max Operating Temperature: 150°C; Features: High Temperature; Voltage Rating: 25V; REACH SVHC: No SVHC; Series: C; Package Quantity: 10000; Mount: Surface Mount; Dielectric Material: Ceramic; Case Code (Imperial): 0402; Lead Free: Lead Free; Thickness: 0.022inch; Height: 0.5mm; Min Operating Temperature: -55°C; Category: Capacitor
C?#5-C?#7 C?#13-C?#15 C?#21 C?#26 C?#31 C?#36 = CMP-08246-004908-1: Ceramic Capacitor  - 4.7μF ±10% 25V X5R SMD 0805; Lead Free: Lead Free; Thickness: 0.057inch; Packaging: Tape and Reel; Min Operating Temperature: -55°C; RoHS Compliant: Yes; Dielectric: X5R; Weight: 0.000194oz; REACH SVHC: No SVHC; Voltage Rating (DC): 25V; Mount: Surface Mount; Capacitance: 4.7uF; Resistor Type: Ceramic; Termination: SMD/SMT; Number of Pins: 2; Case Code (Imperial): 0805; Dielectric Material: Ceramic; Voltage: 25V; Voltage Rating: 25V; Case Code (Metric): 2012; Case/Package: 0805; Max Operating Temperature: 85°C; Height: 1.25mm; Tolerance: 10%; Depth: 1.25mm; Package Quantity: 1; Length: 2mm; Radiation Hardening: No; Width: 1.25mm; Category: Capacitor
C?#8-C?#12 C?#16-C?#20 = CMP-08246-002186-1: Cap Ceramic 100nF 25V X7R 10% Pad SMD 0603 +125°C Automotive T/R; Composition: Ceramic; Dielectric: X7R; Ratings: AEC-Q200; Length: 1.6mm; REACH SVHC: No SVHC; Width: 0.031inch; Packaging: Tape and Reel; Case/Package: 0603; Height: 0.8mm; Termination: SMD/SMT; Max Operating Temperature: 125°C; Thickness: 0.035inch; Case Code (Metric): 1608; Lead Free: Lead Free; Mount: Surface Mount; Voltage Rating (DC): 25V; Capacitance: 100nF; Voltage Rating: 25V; Tolerance: 10%; Weight: 7.1E-05oz; Min Operating Temperature: -55°C; Package Quantity: 1; Depth: 0.8mm; Case Code (Imperial): 0603; Category: Capacitor
C?#22 C?#23 C?#27 C?#28 C?#32 C?#33 C?#37 C?#38 = CMP-2000-05009-2: Ceramic Capacitor - 0.47UF 10V X5R 0402; Manufacturer: Murata Electronics North America; Manufacturer Part Number: GRM155R61A474KE15D; Temperature Coefficient: 15%; Tolerance: 10%; Device Class L3: Ceramic Capacitors; ComponentLink2Description: Datasheet; ComponentLink2URL: https://search.murata.co.jp/Ceramy/image/img/A01X/G101/ENG/GRM155R61A474KE15-01A.pdf; Package: GRM15-0.1; Voltage Rating: 10V; Capacitance: 0.47uF; Category: Cap; Temperature Range High: +85°C; Temperature Range Low: -55°C; Height: 0.55mm; Device Class L2: Capacitors; Lead Free: Yes; Mouser Description: Multilayer Ceramic Capacitors MLCC - SMD/SMT 0402 0.47uF 10volts X5R 10%; Ipc Land Pattern Name: CAPC10050X50; Temperature Characteristic: X5R; Digikey Description: CAP CER 0.47UF 10V X5R 0402; Value: 0.47uF; Octopart: https://octopart.com/grm155r61a474ke15d-murata-196883; Automotive: No; Material: Ceramic; Device Class L1: Passive Components; Temperature: -55°C to +85°C; RoHS: TRUE
C?#24 C?#25 C?#29 C?#30 C?#34 C?#35 C?#39 C?#40 = CMP-03422-000777-1: Ceramic Capacitor - 0.068UF 10V X7R 0402; Manufacturer Part Number: CC0402KRX7R6BB683; Manufacturer: YAGEO; Value: 68 nF; Tolerance: 0.1; Automotive Grade: NA; Temperature Coefficient: 30ppm/°C; Automotive: No; Height: 0.55mm; RoHS: TRUE; Temperature: -55°C to +125°C; Device Class L1: Passive Components; ComponentLink2URL: http://www.yageo.com/documents/recent/UPY-GP_NP0_16V-to-50V_16.pdf; Footprint Url: http://www.yageo.com/exep/pages/download/literatures/UPY-C_GEN_24.pdf; Material: Ceramic; Temperature Range Low: -55°C; Digikey Description: CAP CER 0.068UF 10V X7R 0402; ComponentLink2Description: Datasheet; Temperature Characteristic: X7R; Category: Capacitor; Device Class L2: Capacitors; Lead Free: Yes; Temperature Range High: +125°C; Octopart: https://octopart.com/cc0402krx7r6bb683-yageo-9289272; Capacitance: 68 nF; Package: CC0402; Voltage Rating: 10 V; Device Class L3: Ceramic Capacitors; Mouser Description: Multilayer Ceramic Capacitors MLCC - SMD/SMT 68nF 10V X7R 10%; Ipc Land Pattern Name: CAPC10050X50

## Sheet AD9361 RF Frontend.SchDoc
size A4
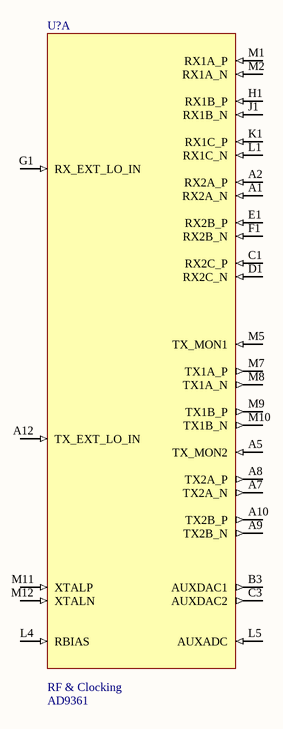
[diagram p5: AD9361 RF Frontend.SchDoc]

### Parts
(Parts that share a designator on the sheet are numbered #1, #2 ... from top to bottom, then left to right.)
U?#7  AD9361  [BGA144C80P12X12_1000X1000X170]  (part A of 4)

### Nets

Not connected (* = marked no-connect by the designer): U?#7 A1(RX2A_N) A2(RX2A_P) A5(TX_MON2) A7(TX2A_N) A8(TX2A_P) A9(TX2B_N) A10(TX2B_P) A12(TX_EXT_LO_IN) B3(AUXDAC1) C1(RX2C_P) C3(AUXDAC2) D1(RX2C_N) E1(RX2B_P) F1(RX2B_N) G1(RX_EXT_LO_IN) H1(RX1B_P) J1(RX1B_N) K1(RX1C_P) L1(RX1C_N) L4(RBIAS) L5(AUXADC) M1(RX1A_P) M2(RX1A_N) M5(TX_MON1) M7(TX1A_P) M8(TX1A_N) M9(TX1B_P) M10(TX1B_N) M11(XTALP) M12(XTALN)

### Notes on the sheet
- Title
- Size:
- Date:
- A3
- Drawn by:
- Time:
- Revision:
- Sheet
- of
- File:
- (in symbol AD9361, part A) RF & Clocking

### Library data of the parts
U?#7 = AD9361: RF Agile Transceiver 2Tx x 2Rx

## Sheet AD9361 Baseband and Control.SchDoc
size A4
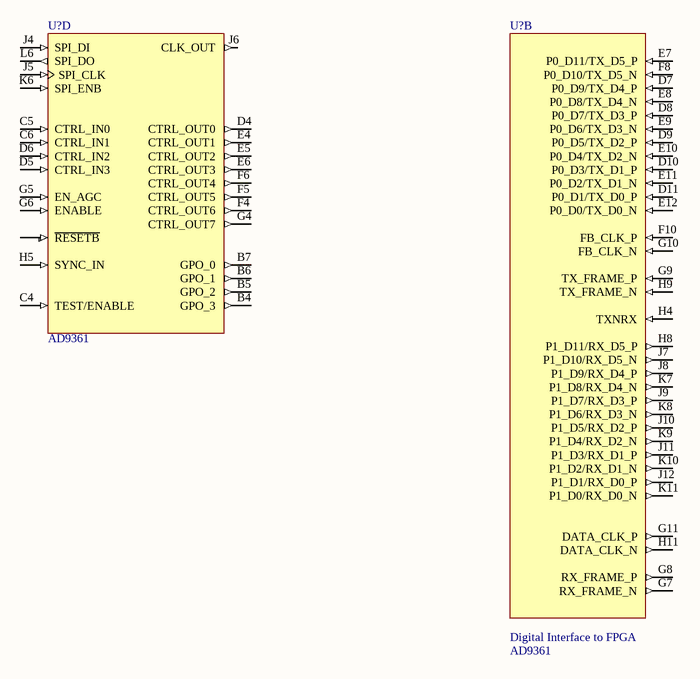
[diagram p6: AD9361 Baseband and Control.SchDoc]

### Parts
(Parts that share a designator on the sheet are numbered #1, #2 ... from top to bottom, then left to right.)
U?#8  AD9361  [BGA144C80P12X12_1000X1000X170]  (part D of 4)
U?#9  AD9361  [BGA144C80P12X12_1000X1000X170]  (part B of 4)

### Nets

Not connected (* = marked no-connect by the designer): U?#8 ?1(~{RESETB}) B4(GPO_3) B5(GPO_2) B6(GPO_1) B7(GPO_0) C4(TEST/ENABLE) C5(CTRL_IN0) C6(CTRL_IN1) D4(CTRL_OUT0) D5(CTRL_IN3) D6(CTRL_IN2) E4(CTRL_OUT1) E5(CTRL_OUT2) E6(CTRL_OUT3) F4(CTRL_OUT6) F5(CTRL_OUT5) F6(CTRL_OUT4) G4(CTRL_OUT7) G5(EN_AGC) G6(ENABLE) H5(SYNC_IN) J4(SPI_DI) J5(SPI_CLK) J6(CLK_OUT) K6(SPI_ENB) L6(SPI_DO); U?#9 D7(P0_D9/TX_D4_P) D8(P0_D7/TX_D3_P) D9(P0_D5/TX_D2_P) D10(P0_D3/TX_D1_P) D11(P0_D1/TX_D0_P) E7(P0_D11/TX_D5_P) E8(P0_D8/TX_D4_N) E9(P0_D6/TX_D3_N) E10(P0_D4/TX_D2_N) E11(P0_D2/TX_D1_N) E12(P0_D0/TX_D0_N) F8(P0_D10/TX_D5_N) F10(FB_CLK_P) G7(RX_FRAME_N) G8(RX_FRAME_P) G9(TX_FRAME_P) G10(FB_CLK_N) G11(DATA_CLK_P) H4(TXNRX) H8(P1_D11/RX_D5_P) H9(TX_FRAME_N) H11(DATA_CLK_N) J7(P1_D10/RX_D5_N) J8(P1_D9/RX_D4_P) J9(P1_D7/RX_D3_P) J10(P1_D5/RX_D2_P) J11(P1_D3/RX_D1_P) J12(P1_D1/RX_D0_P) K7(P1_D8/RX_D4_N) K8(P1_D6/RX_D3_N) K9(P1_D4/RX_D2_N) K10(P1_D2/RX_D1_N) K11(P1_D0/RX_D0_N)

### Notes on the sheet
- Title
- Size:
- Date:
- A3
- Drawn by:
- Time:
- Revision:
- Sheet
- of
- File:
- (in symbol AD9361, part B) Digital Interface to FPGA

### Library data of the parts
U?#8 U?#9 = AD9361: RF Agile Transceiver 2Tx x 2Rx

## Sheet AD9361 Power.SchDoc
size A4
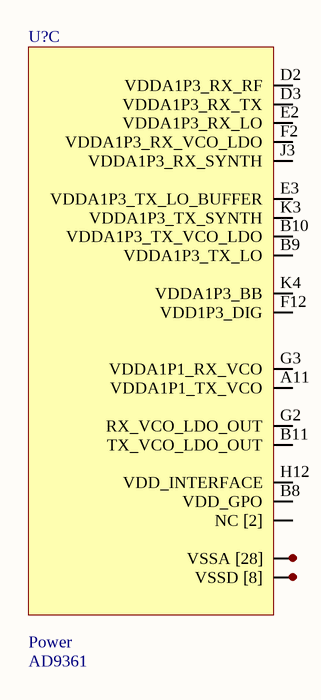
[diagram p7: AD9361 Power.SchDoc]

### Parts
(Parts that share a designator on the sheet are numbered #1, #2 ... from top to bottom, then left to right.)
U?#10  AD9361  [BGA144C80P12X12_1000X1000X170]  (part C of 4)

### Nets
NetU?#10_A3: U?#10.A3(NC_[2]) U?#10.M3(M14)
NetU?#10_A4: U?#10.A4(VSSA_[28]) U?#10.A6 U?#10.B1(M15) U?#10.B2(M16) U?#10.B12(M17) U?#10.C2(M18) U?#10.C7(M19) U?#10.C8(M20) U?#10.C9(M22) U?#10.C10(M21) U?#10.C11(M23) U?#10.C12(M24) U?#10.F3(M26) U?#10.H2(M25) U?#10.H3(M13) U?#10.H6(M14) U?#10.J2(M15) U?#10.K2(M16) U?#10.L2(M17) U?#10.L3(M18) U?#10.L7(M19) U?#10.L8(M20) U?#10.L9(M21) U?#10.L10(M22) U?#10.L11(M23) U?#10.L12(M24) U?#10.M4(M25) U?#10.M6(M26)
NetU?#10_D12: U?#10.D12(VSSD_[8]) U?#10.F7(M14) U?#10.F9(M15) U?#10.F11(M16) U?#10.G12(M17) U?#10.H7(M18) U?#10.H10(M19) U?#10.K12(M20)

Not connected (* = marked no-connect by the designer): U?#10 A11(VDDA1P1_TX_VCO) B8(VDD_GPO) B9(VDDA1P3_TX_LO) B10(VDDA1P3_TX_VCO_LDO) B11(TX_VCO_LDO_OUT) D2(VDDA1P3_RX_RF) D3(VDDA1P3_RX_TX) E2(VDDA1P3_RX_LO) E3(VDDA1P3_TX_LO_BUFFER) F2(VDDA1P3_RX_VCO_LDO) F12(VDD1P3_DIG) G2(RX_VCO_LDO_OUT) G3(VDDA1P1_RX_VCO) H12(VDD_INTERFACE) J3(VDDA1P3_RX_SYNTH) K3(VDDA1P3_TX_SYNTH) K4(VDDA1P3_BB)

### Notes on the sheet
- Title
- Size:
- Date:
- A3
- Drawn by:
- Time:
- Revision:
- Sheet
- of
- File:
- (in symbol AD9361, part C) Power

### Library data of the parts
U?#10 = AD9361: RF Agile Transceiver 2Tx x 2Rx

## Nets that join several sheets
+1.35V: DDR3 Memory Module One (40 pins), DDR3 Memory Module Two (40 pins), Memory Controller (C?#1.2 C?#2.2 R?#29.2 R?#30.1), DDR3L Bypassing (58 pins)
PS_DDR_VREF0: DDR3 Memory Module One (U?#4.H1 U?#4.M8), DDR3 Memory Module Two (U?#5.H1 U?#5.M8), Memory Controller (C?#1.1 C?#2.1 U?#6.H6 U?#6.P6), DDR3L Bypassing (C?#3.1 C?#4.1)
VTTDDR_PS: DDR3 Memory Module Two (24 pins), DDR3L Bypassing (16 pins)
PS_DDR3_A0: DDR3 Memory Module One (U?#4.N3), DDR3 Memory Module Two (R?#13.1 U?#5.N3), Memory Controller (U?#6.N2)
PS_DDR3_A1: DDR3 Memory Module One (U?#4.P7), DDR3 Memory Module Two (R?#14.1 U?#5.P7), Memory Controller (U?#6.K2)
PS_DDR3_A2: DDR3 Memory Module One (U?#4.P3), DDR3 Memory Module Two (R?#15.1 U?#5.P3), Memory Controller (U?#6.M3)
PS_DDR3_A3: DDR3 Memory Module One (U?#4.N2), DDR3 Memory Module Two (R?#16.1 U?#5.N2), Memory Controller (U?#6.K3)
PS_DDR3_A4: DDR3 Memory Module One (U?#4.P8), DDR3 Memory Module Two (R?#17.1 U?#5.P8), Memory Controller (U?#6.M4)
PS_DDR3_A5: DDR3 Memory Module One (U?#4.P2), DDR3 Memory Module Two (R?#18.1 U?#5.P2), Memory Controller (U?#6.L1)
PS_DDR3_A6: DDR3 Memory Module One (U?#4.R8), DDR3 Memory Module Two (R?#19.1 U?#5.R8), Memory Controller (U?#6.L4)
PS_DDR3_A7: DDR3 Memory Module One (U?#4.R2), DDR3 Memory Module Two (R?#20.1 U?#5.R2), Memory Controller (U?#6.K4)
PS_DDR3_A8: DDR3 Memory Module One (U?#4.T8), DDR3 Memory Module Two (R?#21.1 U?#5.T8), Memory Controller (U?#6.K1)
PS_DDR3_A9: DDR3 Memory Module One (U?#4.R3), DDR3 Memory Module Two (R?#22.1 U?#5.R3), Memory Controller (U?#6.J4)
PS_DDR3_A10: DDR3 Memory Module One (U?#4.L7), DDR3 Memory Module Two (R?#23.1 U?#5.L7), Memory Controller (U?#6.F5)
PS_DDR3_A11: DDR3 Memory Module One (U?#4.R7), DDR3 Memory Module Two (R?#24.1 U?#5.R7), Memory Controller (U?#6.G4)
PS_DDR3_A12: DDR3 Memory Module One (U?#4.N7), DDR3 Memory Module Two (R?#25.1 U?#5.N7), Memory Controller (U?#6.E4)
PS_DDR3_A13: DDR3 Memory Module One (U?#4.T3), DDR3 Memory Module Two (R?#26.1 U?#5.T3), Memory Controller (U?#6.D4)
PS_DDR3_A14: DDR3 Memory Module One (U?#4.T7), DDR3 Memory Module Two (R?#27.1 U?#5.T7), Memory Controller (U?#6.F4)
PS_DDR3_BA0: DDR3 Memory Module One (U?#4.M2), DDR3 Memory Module Two (R?#5.1 U?#5.M2), Memory Controller (U?#6.L5)
PS_DDR3_BA1: DDR3 Memory Module One (U?#4.N8), DDR3 Memory Module Two (R?#6.1 U?#5.N8), Memory Controller (U?#6.R4)
PS_DDR3_BA2: DDR3 Memory Module One (U?#4.M3), DDR3 Memory Module Two (R?#7.1 U?#5.M3), Memory Controller (U?#6.J5)
PS_DDR3_CAS_B: DDR3 Memory Module One (U?#4.K3), DDR3 Memory Module Two (R?#9.1 U?#5.K3), Memory Controller (U?#6.P5)
PS_DDR3_CKE: DDR3 Memory Module One (U?#4.K9), DDR3 Memory Module Two (R?#8.1 U?#5.K9), Memory Controller (U?#6.N3)
PS_DDR3_CLK_N: DDR3 Memory Module One (R?#2.2 U?#4.K7), DDR3 Memory Module Two (R?#28.1 U?#5.K7), Memory Controller (U?#6.M2)
PS_DDR3_CLK_P: DDR3 Memory Module One (R?#2.1 U?#4.J7), DDR3 Memory Module Two (R?#28.2 U?#5.J7), Memory Controller (U?#6.L2)
PS_DDR3_CS_B: DDR3 Memory Module One (U?#4.L2), DDR3 Memory Module Two (R?#4.1 U?#5.L2), Memory Controller (U?#6.N1)
PS_DDR3_DQ0: DDR3 Memory Module Two (U?#5.E3), Memory Controller (U?#6.C3)
PS_DDR3_DQ1: DDR3 Memory Module Two (U?#5.F7), Memory Controller (U?#6.B3)
PS_DDR3_DQ2: DDR3 Memory Module Two (U?#5.F2), Memory Controller (U?#6.A2)
PS_DDR3_DQ3: DDR3 Memory Module Two (U?#5.F8), Memory Controller (U?#6.A4)
PS_DDR3_DQ4: DDR3 Memory Module Two (U?#5.H3), Memory Controller (U?#6.D3)
PS_DDR3_DQ5: DDR3 Memory Module Two (U?#5.H8), Memory Controller (U?#6.D1)
PS_DDR3_DQ6: DDR3 Memory Module Two (U?#5.G2), Memory Controller (U?#6.C1)
PS_DDR3_DQ7: DDR3 Memory Module Two (U?#5.H7), Memory Controller (U?#6.E1)
PS_DDR3_DQ8: DDR3 Memory Module Two (U?#5.D7), Memory Controller (U?#6.E2)
PS_DDR3_DQ9: DDR3 Memory Module Two (U?#5.C3), Memory Controller (U?#6.E3)
PS_DDR3_DQ10: DDR3 Memory Module Two (U?#5.C8), Memory Controller (U?#6.G3)
PS_DDR3_DQ11: DDR3 Memory Module Two (U?#5.C2), Memory Controller (U?#6.H3)
PS_DDR3_DQ12: DDR3 Memory Module Two (U?#5.A7), Memory Controller (U?#6.J3)
PS_DDR3_DQ13: DDR3 Memory Module Two (U?#5.A2), Memory Controller (U?#6.H2)
PS_DDR3_DQ14: DDR3 Memory Module Two (U?#5.B8), Memory Controller (U?#6.H1)
PS_DDR3_DQ15: DDR3 Memory Module Two (U?#5.A3), Memory Controller (U?#6.J1)
PS_DDR3_DQ16: DDR3 Memory Module One (U?#4.E3), Memory Controller (U?#6.P1)
PS_DDR3_DQ17: DDR3 Memory Module One (U?#4.F7), Memory Controller (U?#6.P3)
PS_DDR3_DQ18: DDR3 Memory Module One (U?#4.F2), Memory Controller (U?#6.R3)
PS_DDR3_DQ19: DDR3 Memory Module One (U?#4.F8), Memory Controller (U?#6.R1)
PS_DDR3_DQ20: DDR3 Memory Module One (U?#4.H3), Memory Controller (U?#6.T4)
PS_DDR3_DQ21: DDR3 Memory Module One (U?#4.H8), Memory Controller (U?#6.U4)
PS_DDR3_DQ22: DDR3 Memory Module One (U?#4.G2), Memory Controller (U?#6.U2)
PS_DDR3_DQ23: DDR3 Memory Module One (U?#4.H7), Memory Controller (U?#6.U3)
PS_DDR3_DQ24: DDR3 Memory Module One (U?#4.D7), Memory Controller (U?#6.V1)
PS_DDR3_DQ25: DDR3 Memory Module One (U?#4.C3), Memory Controller (U?#6.Y3)
PS_DDR3_DQ26: DDR3 Memory Module One (U?#4.C8), Memory Controller (U?#6.W1)
PS_DDR3_DQ27: DDR3 Memory Module One (U?#4.C2), Memory Controller (U?#6.Y4)
PS_DDR3_DQ28: DDR3 Memory Module One (U?#4.A7), Memory Controller (U?#6.Y2)
PS_DDR3_DQ29: DDR3 Memory Module One (U?#4.A2), Memory Controller (U?#6.W3)
PS_DDR3_DQ30: DDR3 Memory Module One (U?#4.B8), Memory Controller (U?#6.V2)
PS_DDR3_DQ31: DDR3 Memory Module One (U?#4.A3), Memory Controller (U?#6.V3)
PS_DDR3_DQS0_N: DDR3 Memory Module Two (U?#5.G3), Memory Controller (U?#6.B2)
PS_DDR3_DQS0_P: DDR3 Memory Module Two (U?#5.F3), Memory Controller (U?#6.C2)
PS_DDR3_DQS1_N: DDR3 Memory Module Two (U?#5.B7), Memory Controller (U?#6.F2)
PS_DDR3_DQS1_P: DDR3 Memory Module Two (U?#5.C7), Memory Controller (U?#6.G2)
PS_DDR3_DQS2_N: DDR3 Memory Module One (U?#4.G3), Memory Controller (U?#6.T2)
PS_DDR3_DQS2_P: DDR3 Memory Module One (U?#4.F3), Memory Controller (U?#6.R2)
PS_DDR3_DQS3_N: DDR3 Memory Module One (U?#4.B7), Memory Controller (U?#6.W4)
PS_DDR3_DQS3_P: DDR3 Memory Module One (U?#4.C7), Memory Controller (U?#6.W5)
PS_DDR3_M0: DDR3 Memory Module Two (U?#5.E7), Memory Controller (U?#6.A1)
PS_DDR3_M1: DDR3 Memory Module Two (U?#5.D3), Memory Controller (U?#6.F1)
PS_DDR3_M2: DDR3 Memory Module One (U?#4.E7), Memory Controller (U?#6.T1)
PS_DDR3_M3: DDR3 Memory Module One (U?#4.D3), Memory Controller (U?#6.Y1)
PS_DDR3_ODT: DDR3 Memory Module One (U?#4.K1), DDR3 Memory Module Two (R?#3.1 U?#5.K1), Memory Controller (U?#6.N5)
PS_DDR3_RAS_B: DDR3 Memory Module One (U?#4.J3), DDR3 Memory Module Two (R?#10.1 U?#5.J3), Memory Controller (U?#6.P4)
PS_DDR3_RST_B: DDR3 Memory Module One (U?#4.T2), DDR3 Memory Module Two (U?#5.T2), Memory Controller (U?#6.B4)
PS_DDR3_WE_B: DDR3 Memory Module One (U?#4.L3), DDR3 Memory Module Two (R?#11.1 U?#5.L3), Memory Controller (U?#6.M5)